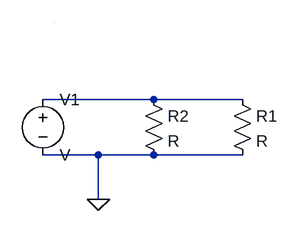
[diagram p0: schematic ltspice-file.asc]
ltspice-file.asc, the LTspice schematic file:
Version 4
SHEET 1 880 680
WIRE 144 112 -16 112
WIRE 272 112 144 112
WIRE 64 192 -16 192
WIRE 144 192 64 192
WIRE 272 192 144 192
WIRE 64 256 64 192
WIRE 0 0 0 0
FLAG 64 256 0
SYMBOL res 256 96 R0
SYMATTR InstName R1
SYMBOL voltage -16 96 R0
SYMATTR InstName V1
SYMBOL res 128 96 R0
SYMATTR InstName R2

The netlist it stands for:
* ltspice-file.asc
R1 N001 0 R
V1 N001 0 V
R2 N001 0 R
.backanno
.end